# Altium schematic sheet config.SchDoc
size A4
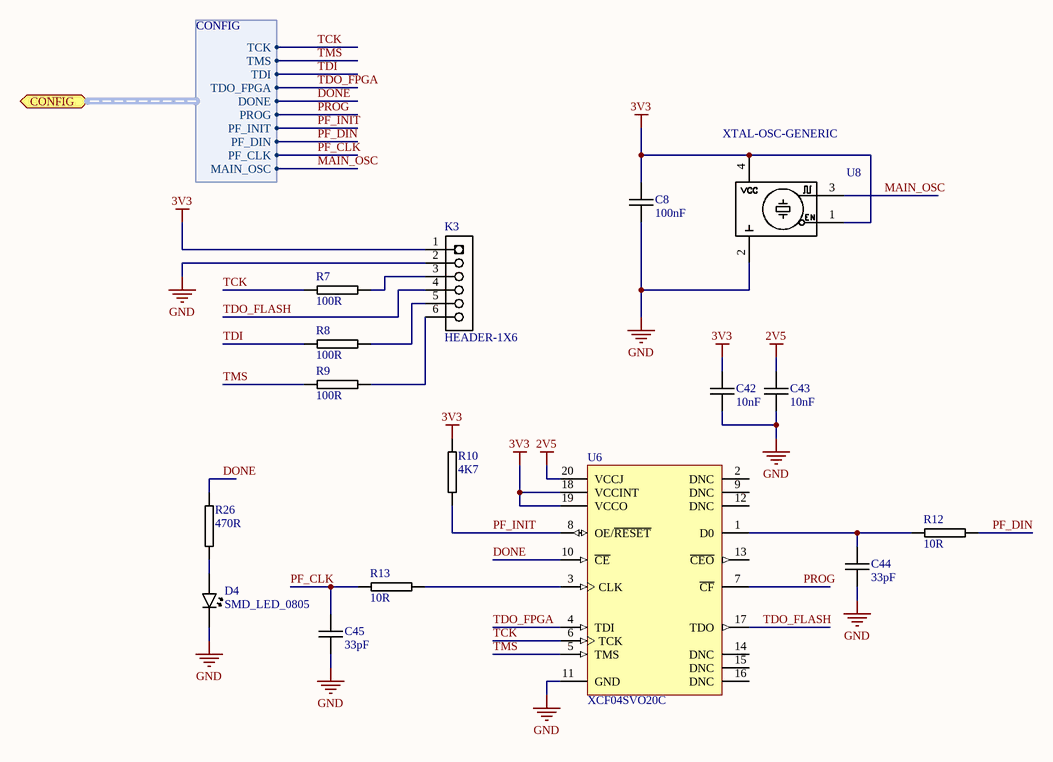
[diagram p0: config.SchDoc]

## Parts
C8  100nF  [0603C-GENERIC]
C42  10nF  [0603C-GENERIC]
C43  10nF  [0603C-GENERIC]
C44  33pF  [0603C-GENERIC]
C45  33pF  [0603C-GENERIC]
D4  SMD_LED_0805  [CD2012-0805]
K3  HEADER-1X6  [HEADER-1X6]
R7  100R  [0603R-100]
R8  100R  [0603R-100]
R9  100R  [0603R-100]
R10  4K7  [0603R-4K7]
R12  10R  [0603R-10]
R13  10R  [0603R-10]
R26  470R  [0603R-470]
U6  XCF04SVO20C  [VO20_N]
U8  XTAL-OSC-GENERIC  [XOSC-5X7]

## Ports
CONFIG (harness CONFIG)

## Harnesses
CONFIG: TCK, TMS, TDI, TDO_FPGA, DONE, PROG, PF_DIN, PF_INIT, PF_CLK, MAIN_OSC

## Nets
2V5: C43.1 U6.20(VCCJ)
3V3: C8.1 C42.1 K3.1 R10.1 U6.18(VCCINT) U6.19(VCCO) U8.1(EN) U8.4(VCC)
GND: C8.2 C42.2 C43.2 C44.2 C45.2 D4.2(K) K3.2 U6.11(GND) U8.2(GND)
DONE: R26.1 U6.10(~{CE}) ; port CONFIG.DONE
MAIN_OSC: U8.3(OUT) ; port CONFIG.MAIN_OSC
PF_CLK: C45.1 R13.1 ; port CONFIG.PF_CLK
PF_DIN: R12.2 ; port CONFIG.PF_DIN
PF_INIT: R10.2 U6.8(OE/~{RESET}) ; port CONFIG.PF_INIT
PROG: U6.7(~{CF}) ; port CONFIG.PROG
TCK: R7.1 U6.6(TCK) ; port CONFIG.TCK
TDI: R8.1 ; port CONFIG.TDI
TDO_FLASH: K3.4 U6.17(TDO)
TDO_FPGA: U6.4(TDI) ; port CONFIG.TDO_FPGA
TMS: R9.1 U6.5(TMS) ; port CONFIG.TMS
NetC44_1: C44.1 R12.1 U6.1(D0)
NetD4_1: D4.1(A) R26.2
NetK3_3: K3.3 R7.2
NetK3_5: K3.5 R8.2
NetK3_6: K3.6 R9.2
NetR13_2: R13.2 U6.3(CLK)

Not connected (* = marked no-connect by the designer): U6 2(DNC) 9(DNC) 12(DNC) 13(~{CEO}) 14(DNC) 15(DNC) 16(DNC)

## Library data of the parts
C8 = 0603C-100NF-50V-X7R-TDK: GENERIC CAPACITOR NON POLARISED 0603; Manufacturer Part Number: C1608X7R1H103K; Manufacturer: TDK Corporation; Temperature Coefficient: X7R; Tolerance: ±10%; Voltage - Rated: 50V; Capacitance: 10000pF; Description: CAP CER 10000PF 50V X7R 10% 0603; Reel: C68; RoHS: RoHS Compliant; Lead Spacing: -; Package / Case: 0603 (1608 metric); Features: General Purpose; Packaging: Tape & Reel (TR); Thickness: 0.80mm; Operating Temperature: -55°C ~ 125°C; Mounting Type: Surface Mount, MLCC; Category: Capacitors; Supplier 1: Digi-Key; Supplier Part Number 1: 445-1314-2-ND
C42 C43 = 0603C-10NF-50V-X7R-MUR: GENERIC CAPACITOR NON POLARISED 0603; Manufacturer Part Number: GRM188R71H103KA01D; Manufacturer: Murata Electronics North America; Reel: C22; Description: CAP CER 10000PF 50V 10% X7R 0603; Supplier 1: Digi-Key; Supplier Part Number 1: 490-1512-2-ND
C44 C45 = 0603C-33PF-50V-C0G-PAN: GENERIC CAPACITOR NON POLARISED 0603; Reel: C42
R7-R9 = 0603R-100: GENERIC RESISTOR 0603; Manufacturer Part Number: RMCF 1/16 100 1% R; Manufacturer: Stackpole Electronics Inc; Description: RES 100 OHM 1/10W 1% 0603 SMD; Reel: R24; Supplier 1: Digi-Key; Supplier Part Number 1: RMCF1/16100FRDKR-ND
R10 = 0603R-4K7: GENERIC RESISTOR 0603; Manufacturer: Stackpole Electronics Inc; Manufacturer Part Number: RMCF 1/16 4.7K 1% R; Description: RES 4.7K OHM 1/10W 1% 0603 SMD; Reel: R23; Supplier 1: Digi-Key; Supplier Part Number 1: RMCF1/164.7KFRTR-ND
R12 R13 = 0603R-10R: GENERIC RESISTOR 0603; Manufacturer Part Number: RMCF 1/16 10 1% R; Manufacturer: Stackpole Electronics Inc; Description: RES 10 OHM 1/10W 1% 0603 SMD; Resistance In Ohms: 10.0; Tolerance: ±1%; Temperature Coefficient: ±100ppm/°C; Power (Watts): 0.1W, 1/10W; Reel: *; Supplier: Digi-Key; Supplier Part Number: RMCF1/1610FRDKR-ND; Composition: Thick Film; RoHS: RoHS Compliant; Category: Resistors; Lead Style: Surface Mount (SMD - SMT); Packaging: Digi-Reel®; Case: 0603 (1608 metric); Supplier 1: Digi-Key; Supplier Part Number 1: RMCF1/1610FRDKR-ND
R26 = 0603R-470: GENERIC RESISTOR 0603; Manufacturer Part Number: RMCF 1/16 470 1% R; Manufacturer: Stackpole Electronics Inc; Tolerance: ±1%; Power (Watts): 0.1W, 1/10W; Temperature Coefficient: ±100ppm/°C; Resistance In Ohms: 470; Description: RES 470 OHM 1/10W 1% 0603 SMD; Reel: R17; Supplier 1: Digi-Key; Supplier Part Number 1: RMCF1/16470FRTR-ND; Supplier: Digi-Key; Composition: Thick Film; Packaging: Tape & Reel (TR); Lead Style: Surface Mount (SMD - SMT); Category: Resistors; RoHS: RoHS Compliant; Supplier Part Number: RMCF1/16470FRTR-ND; Case: 0603 (1608 metric)
U6 = XCF04SVO20C: XCF00S Series, Platform Flash In-System Programmable Configuration 3.3V PROM, 20-Pin TSOP, 4-Megabit, Commercial Grade; Published: 17-Sep-2003; LatestRevisionDate: 04-Mar-2005; LatestRevisionNote: Stylized 3D Model Added.; DatasheetVersion: ver2.9, May-2006; PackageVersion: ver1.2.1, Apr-2005; PackageReference: VO20; Publisher: Altium Limited; PackageDescription: 20-Pin Thin Shrink Small Outline Package (VO20); Code_JEDEC: MO-153-AC; ComponentLink1Description: Manufacturer Link; ComponentLink1URL: http://www.xilinx.com/products/design_resources/config_sol/index.htm; ComponentLink2Description: Datasheet; ComponentLink2URL: http://direct.xilinx.com/bvdocs/publications/ds123.pdf
U8 = XTAL-OSC-GENERIC: GENERIC CRYSTAL OSCILLATOR
K3 = HEADER-1X6: Supplier 1: Digi-Key; Supplier Part Number 1: S1011E-36-ND